# Altium schematic sheet DDR3_ZET6_OLD.SchDoc
size A3; DocumentNumber: 1; SheetNumber: 1; SheetTotal: 2
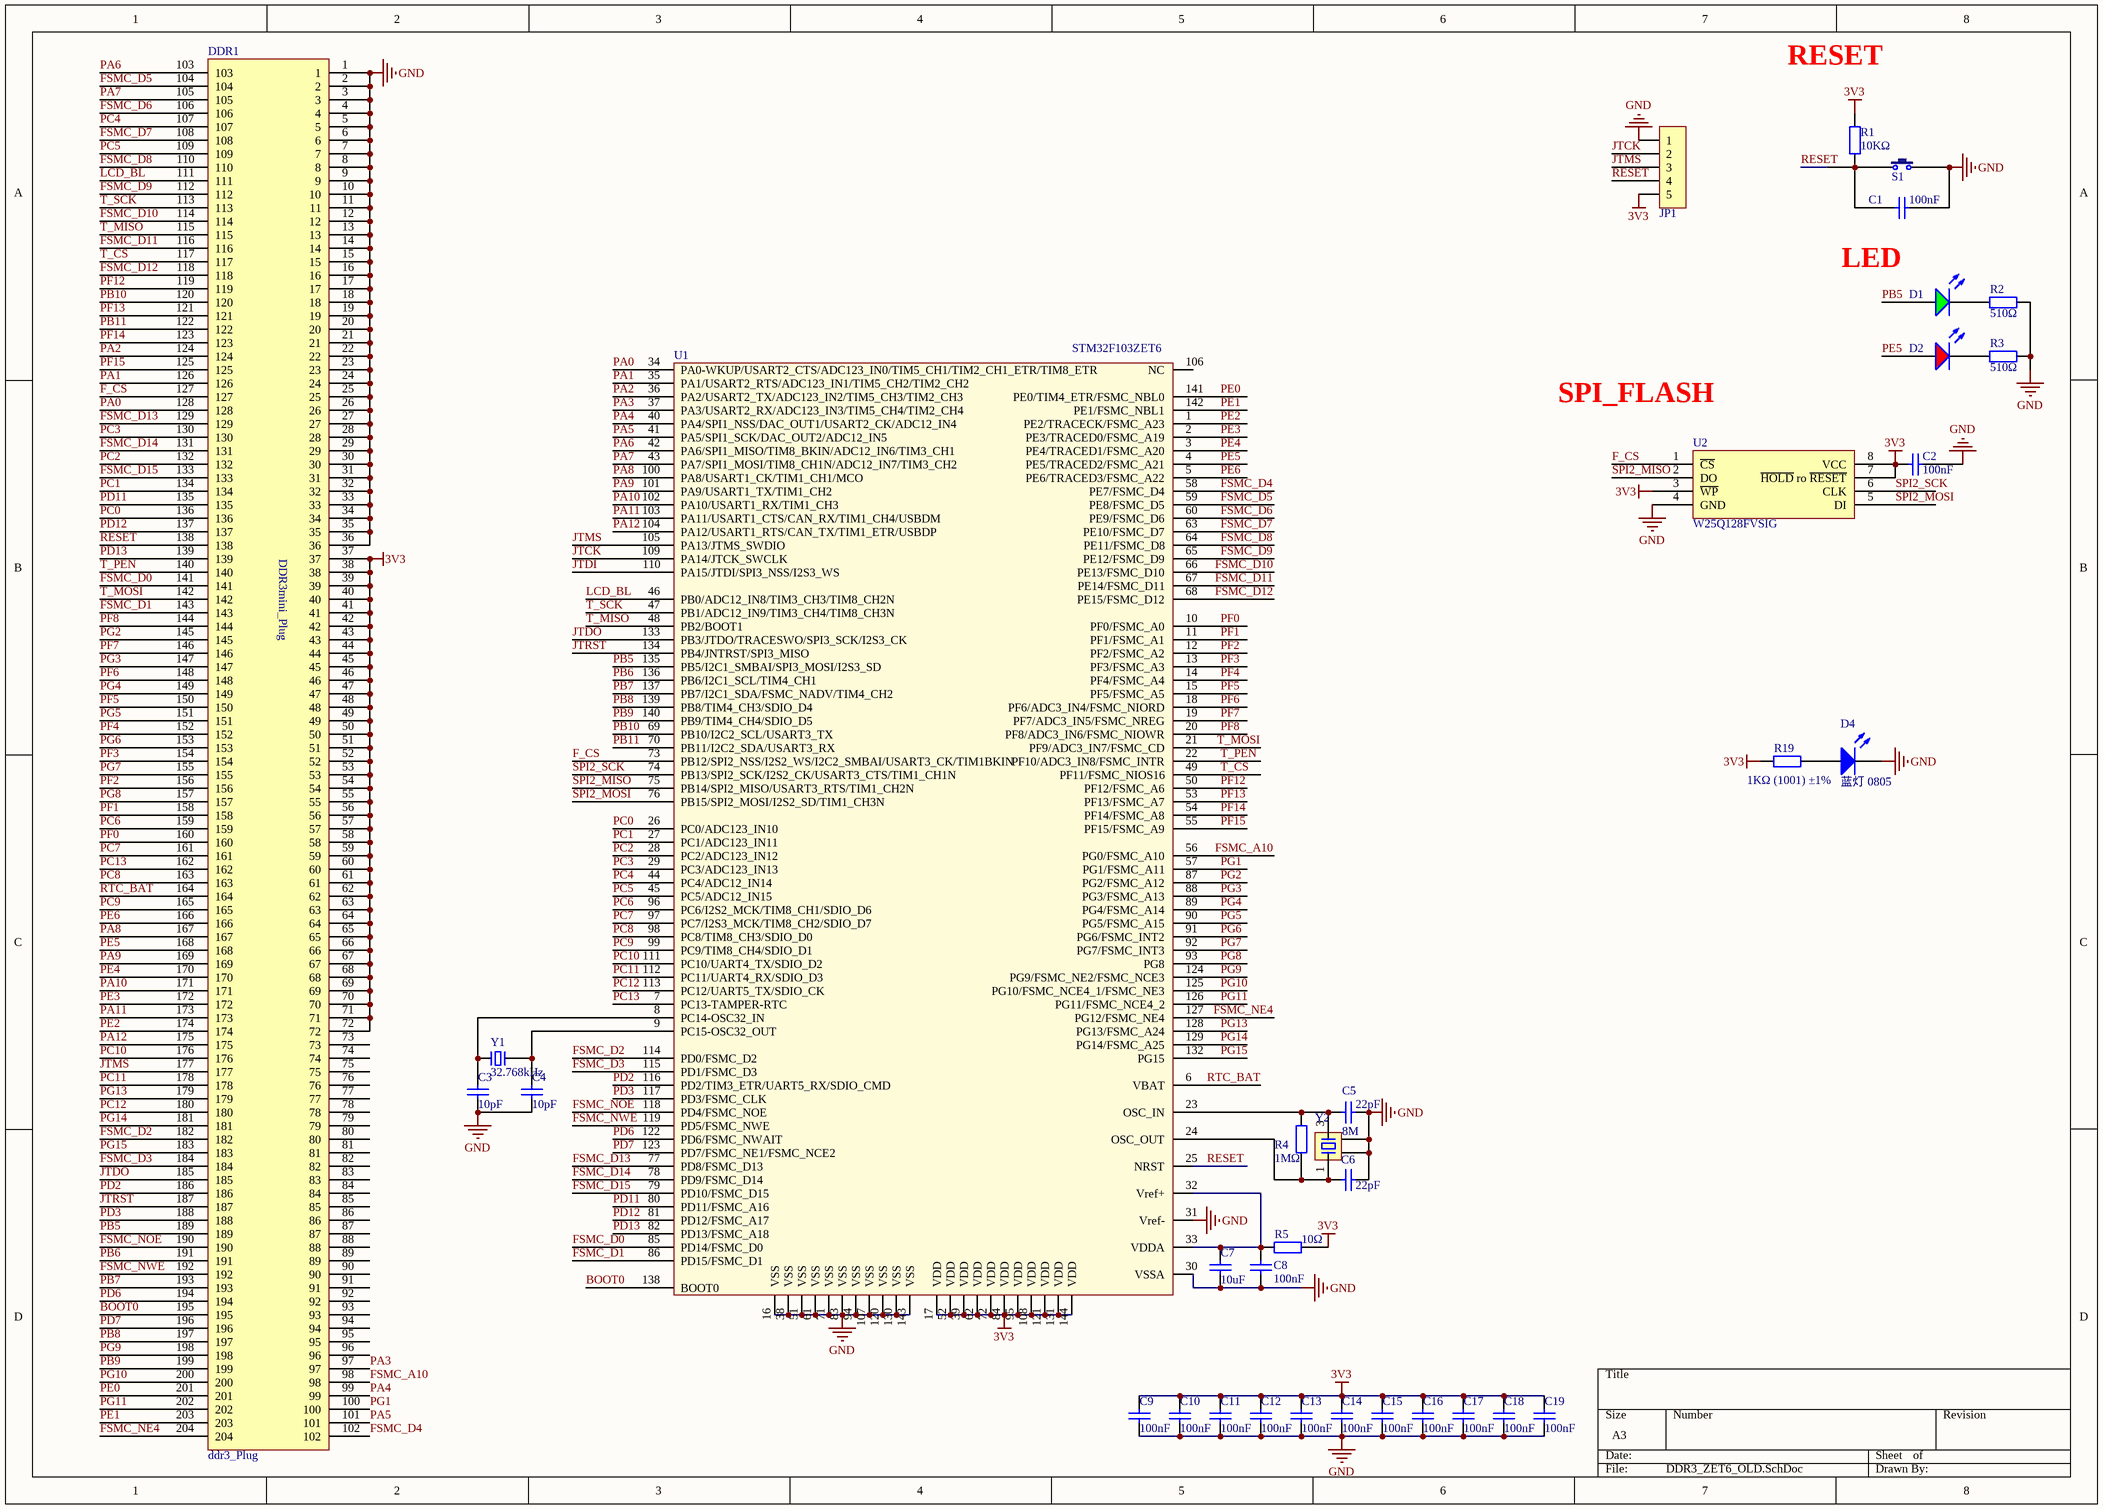
[diagram p0: DDR3_ZET6_OLD.SchDoc]

## Parts
C1  100nF  [LC-0805_C]
C2  100nF  [LC-0805_C]
C3  10pF  [LC-0805_C]
C4  10pF  [LC-0805_C]
C5  22pF  [LC-0805_C]
C6  22pF  [LC-0805_C]
C7  10uF  [LC-0805_C]
C8  100nF  [LC-0805_C]
C9  100nF  [LC-0805_C]
C10  100nF  [LC-0805_C]
C11  100nF  [LC-0805_C]
C12  100nF  [LC-0805_C]
C13  100nF  [LC-0805_C]
C14  100nF  [LC-0805_C]
C15  100nF  [LC-0805_C]
C16  100nF  [LC-0805_C]
C17  100nF  [LC-0805_C]
C18  100nF  [LC-0805_C]
C19  100nF  [LC-0805_C]
D1  翠绿 0805  [LC-0805_LED_S1]  (value not drawn)
D2  红灯 0805  [LC-0805_LED_S1]  (value not drawn)
D4  蓝灯 0805  [LC-0805_LED_S1]
DDR1  ddr3_Plug  [DDR3_PLUG_LTE]
JP1  HDR-1X5  [HDR-1X5]  (value not drawn)
R1  10KΩ  [LC-0805_R]
R2  510Ω  [LC-0805_R]
R3  510Ω  [LC-0805_R]
R4  1MΩ  [LC-0805_R]
R5  10Ω  [LC-0805_R]
R19  1KΩ (1001) ±1%  [LC-0805_R]
S1  RESET  [TSW SMD-3*6*2.5]  (value not drawn)
U1  STM32F103ZET6  [LC-LQFP-144_20x20x05P]
U2  W25Q128FVSIG  [LC-SOIC-8_208mil]
Y1  32.768kHz  [XTAL-3215]
Y2  8M  [XTAL-3225]

## Nets
3V3: C2.1 C9.2 C10.2 C11.2 C12.2 C13.2 C14.2 C15.2 C16.2 C17.2 C18.2 C19.2 DDR1.37 DDR1.38 DDR1.39 DDR1.40 DDR1.41 DDR1.42 DDR1.43 DDR1.44 DDR1.45 DDR1.46 DDR1.47 DDR1.48 DDR1.49 DDR1.50 DDR1.51 DDR1.52 DDR1.53 DDR1.54 DDR1.55 DDR1.56 DDR1.57 DDR1.58 DDR1.59 DDR1.60 DDR1.61 DDR1.62 DDR1.63 DDR1.64 DDR1.65 DDR1.66 DDR1.67 DDR1.68 DDR1.69 DDR1.70 DDR1.71 DDR1.72 JP1.5 R1.2 R5.2 R19.1 U1.17(VDD) U1.39(VDD) U1.52(VDD) U1.62(VDD) U1.72(VDD) U1.84(VDD) U1.95(VDD) U1.108(VDD) U1.121(VDD) U1.131(VDD) U1.144(VDD) U2.3(~{WP}) U2.7(~{HOLD}_ro_~{RESET}) U2.8(VCC)
GND: C1.2 C2.2 C3.1 C4.1 C5.1 C6.1 C7.1 C8.1 C9.1 C10.1 C11.1 C12.1 C13.1 C14.1 C15.1 C16.1 C17.1 C18.1 C19.1 D4.K DDR1.1 DDR1.2 DDR1.3 DDR1.4 DDR1.5 DDR1.6 DDR1.7 DDR1.8 DDR1.9 DDR1.10 DDR1.11 DDR1.12 DDR1.13 DDR1.14 DDR1.15 DDR1.16 DDR1.17 DDR1.18 DDR1.19 DDR1.20 DDR1.21 DDR1.22 DDR1.23 DDR1.24 DDR1.25 DDR1.26 DDR1.27 DDR1.28 DDR1.29 DDR1.30 DDR1.31 DDR1.32 DDR1.33 DDR1.34 DDR1.35 DDR1.36 JP1.1 R2.2 R3.2 S1.2 U1.16(VSS) U1.30(VSSA) U1.31(Vref-) U1.38(VSS) U1.51(VSS) U1.61(VSS) U1.71(VSS) U1.83(VSS) U1.94(VSS) U1.107(VSS) U1.120(VSS) U1.130(VSS) U1.143(VSS) U2.4(GND) Y2.2 Y2.4
BOOT0: DDR1.195 U1.138(BOOT0)
F_CS: DDR1.127 U1.73(PB12/SPI2_NSS/I2S2_WS/I2C2_SMBAI/USART3_CK/TIM1BKIN) U2.1(~{CS})
FSMC_A10: DDR1.98 U1.56(PG0/FSMC_A10)
FSMC_D0: DDR1.141 U1.85(PD14/FSMC_D0)
FSMC_D1: DDR1.143 U1.86(PD15/FSMC_D1)
FSMC_D2: DDR1.182 U1.114(PD0/FSMC_D2)
FSMC_D3: DDR1.184 U1.115(PD1/FSMC_D3)
FSMC_D4: DDR1.102 U1.58(PE7/FSMC_D4)
FSMC_D5: DDR1.104 U1.59(PE8/FSMC_D5)
FSMC_D6: DDR1.106 U1.60(PE9/FSMC_D6)
FSMC_D7: DDR1.108 U1.63(PE10/FSMC_D7)
FSMC_D8: DDR1.110 U1.64(PE11/FSMC_D8)
FSMC_D9: DDR1.112 U1.65(PE12/FSMC_D9)
FSMC_D10: DDR1.114 U1.66(PE13/FSMC_D10)
FSMC_D11: DDR1.116 U1.67(PE14/FSMC_D11)
FSMC_D12: DDR1.118 U1.68(PE15/FSMC_D12)
FSMC_D13: DDR1.129 U1.77(PD8/FSMC_D13)
FSMC_D14: DDR1.131 U1.78(PD9/FSMC_D14)
FSMC_D15: DDR1.133 U1.79(PD10/FSMC_D15)
FSMC_NE4: DDR1.204 U1.127(PG12/FSMC_NE4)
FSMC_NOE: DDR1.190 U1.118(PD4/FSMC_NOE)
FSMC_NWE: DDR1.192 U1.119(PD5/FSMC_NWE)
JTCK: JP1.2 U1.109(PA14/JTCK_SWCLK)
JTDI: U1.110(PA15/JTDI/SPI3_NSS/I2S3_WS)
JTDO: DDR1.185 U1.133(PB3/JTDO/TRACESWO/SPI3_SCK/I2S3_CK)
JTMS: DDR1.177 JP1.3 U1.105(PA13/JTMS_SWDIO)
JTRST: DDR1.187 U1.134(PB4/JNTRST/SPI3_MISO)
LCD_BL: DDR1.111 U1.46(PB0/ADC12_IN8/TIM3_CH3/TIM8_CH2N)
PA0: DDR1.128 U1.34(PA0-WKUP/USART2_CTS/ADC123_IN0/TIM5_CH1/TIM2_CH1_ETR/TIM8_ETR)
PA1: DDR1.126 U1.35(PA1/USART2_RTS/ADC123_IN1/TIM5_CH2/TIM2_CH2)
PA2: DDR1.124 U1.36(PA2/USART2_TX/ADC123_IN2/TIM5_CH3/TIM2_CH3)
PA3: DDR1.97 U1.37(PA3/USART2_RX/ADC123_IN3/TIM5_CH4/TIM2_CH4)
PA4: DDR1.99 U1.40(PA4/SPI1_NSS/DAC_OUT1/USART2_CK/ADC12_IN4)
PA5: DDR1.101 U1.41(PA5/SPI1_SCK/DAC_OUT2/ADC12_IN5)
PA6: DDR1.103 U1.42(PA6/SPI1_MISO/TIM8_BKIN/ADC12_IN6/TIM3_CH1)
PA7: DDR1.105 U1.43(PA7/SPI1_MOSI/TIM8_CH1N/ADC12_IN7/TIM3_CH2)
PA8: DDR1.167 U1.100(PA8/USART1_CK/TIM1_CH1/MCO)
PA9: DDR1.169 U1.101(PA9/USART1_TX/TIM1_CH2)
PA10: DDR1.171 U1.102(PA10/USART1_RX/TIM1_CH3)
PA11: DDR1.173 U1.103(PA11/USART1_CTS/CAN_RX/TIM1_CH4/USBDM)
PA12: DDR1.175 U1.104(PA12/USART1_RTS/CAN_TX/TIM1_ETR/USBDP)
PB5: D1.A DDR1.189 U1.135(PB5/I2C1_SMBAI/SPI3_MOSI/I2S3_SD)
PB6: DDR1.191 U1.136(PB6/I2C1_SCL/TIM4_CH1)
PB7: DDR1.193 U1.137(PB7/I2C1_SDA/FSMC_NADV/TIM4_CH2)
PB8: DDR1.197 U1.139(PB8/TIM4_CH3/SDIO_D4)
PB9: DDR1.199 U1.140(PB9/TIM4_CH4/SDIO_D5)
PB10: DDR1.120 U1.69(PB10/I2C2_SCL/USART3_TX)
PB11: DDR1.122 U1.70(PB11/I2C2_SDA/USART3_RX)
PC0: DDR1.136 U1.26(PC0/ADC123_IN10)
PC1: DDR1.134 U1.27(PC1/ADC123_IN11)
PC2: DDR1.132 U1.28(PC2/ADC123_IN12)
PC3: DDR1.130 U1.29(PC3/ADC123_IN13)
PC4: DDR1.107 U1.44(PC4/ADC12_IN14)
PC5: DDR1.109 U1.45(PC5/ADC12_IN15)
PC6: DDR1.159 U1.96(PC6/I2S2_MCK/TIM8_CH1/SDIO_D6)
PC7: DDR1.161 U1.97(PC7/I2S3_MCK/TIM8_CH2/SDIO_D7)
PC8: DDR1.163 U1.98(PC8/TIM8_CH3/SDIO_D0)
PC9: DDR1.165 U1.99(PC9/TIM8_CH4/SDIO_D1)
PC10: DDR1.176 U1.111(PC10/UART4_TX/SDIO_D2)
PC11: DDR1.178 U1.112(PC11/UART4_RX/SDIO_D3)
PC12: DDR1.180 U1.113(PC12/UART5_TX/SDIO_CK)
PC13: DDR1.162 U1.7(PC13-TAMPER-RTC)
PD2: DDR1.186 U1.116(PD2/TIM3_ETR/UART5_RX/SDIO_CMD)
PD3: DDR1.188 U1.117(PD3/FSMC_CLK)
PD6: DDR1.194 U1.122(PD6/FSMC_NWAIT)
PD7: DDR1.196 U1.123(PD7/FSMC_NE1/FSMC_NCE2)
PD11: DDR1.135 U1.80(PD11/FSMC_A16)
PD12: DDR1.137 U1.81(PD12/FSMC_A17)
PD13: DDR1.139 U1.82(PD13/FSMC_A18)
PE0: DDR1.201 U1.141(PE0/TIM4_ETR/FSMC_NBL0)
PE1: DDR1.203 U1.142(PE1/FSMC_NBL1)
PE2: DDR1.174 U1.1(PE2/TRACECK/FSMC_A23)
PE3: DDR1.172 U1.2(PE3/TRACED0/FSMC_A19)
PE4: DDR1.170 U1.3(PE4/TRACED1/FSMC_A20)
PE5: D2.A DDR1.168 U1.4(PE5/TRACED2/FSMC_A21)
PE6: DDR1.166 U1.5(PE6/TRACED3/FSMC_A22)
PF0: DDR1.160 U1.10(PF0/FSMC_A0)
PF1: DDR1.158 U1.11(PF1/FSMC_A1)
PF2: DDR1.156 U1.12(PF2/FSMC_A2)
PF3: DDR1.154 U1.13(PF3/FSMC_A3)
PF4: DDR1.152 U1.14(PF4/FSMC_A4)
PF5: DDR1.150 U1.15(PF5/FSMC_A5)
PF6: DDR1.148 U1.18(PF6/ADC3_IN4/FSMC_NIORD)
PF7: DDR1.146 U1.19(PF7/ADC3_IN5/FSMC_NREG)
PF8: DDR1.144 U1.20(PF8/ADC3_IN6/FSMC_NIOWR)
PF12: DDR1.119 U1.50(PF12/FSMC_A6)
PF13: DDR1.121 U1.53(PF13/FSMC_A7)
PF14: DDR1.123 U1.54(PF14/FSMC_A8)
PF15: DDR1.125 U1.55(PF15/FSMC_A9)
PG1: DDR1.100 U1.57(PG1/FSMC_A11)
PG2: DDR1.145 U1.87(PG2/FSMC_A12)
PG3: DDR1.147 U1.88(PG3/FSMC_A13)
PG4: DDR1.149 U1.89(PG4/FSMC_A14)
PG5: DDR1.151 U1.90(PG5/FSMC_A15)
PG6: DDR1.153 U1.91(PG6/FSMC_INT2)
PG7: DDR1.155 U1.92(PG7/FSMC_INT3)
PG8: DDR1.157 U1.93(PG8)
PG9: DDR1.198 U1.124(PG9/FSMC_NE2/FSMC_NCE3)
PG10: DDR1.200 U1.125(PG10/FSMC_NCE4_1/FSMC_NE3)
PG11: DDR1.202 U1.126(PG11/FSMC_NCE4_2)
PG13: DDR1.179 U1.128(PG13/FSMC_A24)
PG14: DDR1.181 U1.129(PG14/FSMC_A25)
PG15: DDR1.183 U1.132(PG15)
RESET: C1.1 DDR1.138 JP1.4 R1.1 S1.1 U1.25(NRST)
RTC_BAT: DDR1.164 U1.6(VBAT)
SPI2_MISO: U1.75(PB14/SPI2_MISO/USART3_RTS/TIM1_CH2N) U2.2(DO)
SPI2_MOSI: U1.76(PB15/SPI2_MOSI/I2S2_SD/TIM1_CH3N) U2.5(DI)
SPI2_SCK: U1.74(PB13/SPI2_SCK/I2S2_CK/USART3_CTS/TIM1_CH1N) U2.6(CLK)
T_CS: DDR1.117 U1.49(PF11/FSMC_NIOS16)
T_MISO: DDR1.115 U1.48(PB2/BOOT1)
T_MOSI: DDR1.142 U1.21(PF9/ADC3_IN7/FSMC_CD)
T_PEN: DDR1.140 U1.22(PF10/ADC3_IN8/FSMC_INTR)
T_SCK: DDR1.113 U1.47(PB1/ADC12_IN9/TIM3_CH4/TIM8_CH3N)
NetC3_2: C3.2 U1.8(PC14-OSC32_IN) Y1.1
NetC4_2: C4.2 U1.9(PC15-OSC32_OUT) Y1.2
NetC5_2: C5.2 R4.1 U1.23(OSC_IN) Y2.3
NetC6_2: C6.2 R4.2 U1.24(OSC_OUT) Y2.1
NetC7_2: C7.2 C8.2 R5.1 U1.32(Vref+) U1.33(VDDA)
NetD1_K: D1.K R2.1
NetD2_K: D2.K R3.1
NetD4_A: D4.A R19.2

Not connected (* = marked no-connect by the designer): DDR1 73 74 75 76 77 78 79 80 81 82 83 84 85 86 87 88 89 90 91 92 93 94 95 96; U1 106(NC)

## Notes on the sheet
- RESET
- LED
- SPI_FLASH
- (in symbol ddr3_Plug) DDR3mini_Plug

## Library data of the parts
C1 C2 C8-C19 = 0805 100nF(104) 10% 50V: 贴片电容; ComponentLink1Description: 供应商链接; ComponentLink1URL: http://www.szlcsc.com/product/details_50686.html; Package: 0805; Supplier: LC; SuppliersPartNumber: C49678
C3 C4 = 0805 10pF (100) 5% 50V: 贴片电容; ComponentLink1Description: 供应商链接; ComponentLink1URL: http://www.szlcsc.com/product/details_2137.html; Package: 0805; Supplier: LC; SuppliersPartNumber: C1785
C5 C6 = 0805 22pF (220) 5% 50V: 贴片电容; ComponentLink1Description: 供应商链接; ComponentLink1URL: http://www.szlcsc.com/product/details_2156.html; Package: 0805; Supplier: LC; SuppliersPartNumber: C1804
C7 = 0805 10uF (106) 10% 25V: 贴片电容; ComponentLink1Description: 供应商链接; ComponentLink1URL: http://www.szlcsc.com/product/details_16532.html; Package: 0805; Supplier: LC; SuppliersPartNumber: C15850
D1 = 0805 翠绿: 发光二极管; ComponentLink1Description: 供应商链接; ComponentLink1URL: http://www.szlcsc.com/product/details_2670.html; Package: 0805; Supplier: LC; SuppliersPartNumber: C2297
D2 = 0805 红灯: 发光二极管; ComponentLink1Description: 供应商链接; ComponentLink1URL: http://www.szlcsc.com/product/details_2668.html; Package: 0805; Supplier: LC; SuppliersPartNumber: C2295
D4 = 0805 蓝灯: 发光二极管; ComponentLink1Description: 供应商链接; ComponentLink1URL: http://www.szlcsc.com/product/details_2666.html; Package: 0805; Supplier: LC; SuppliersPartNumber: C2293
JP1 = Header 5: 5P接插件; 版权归属: 黎明电子style; BOM名称: 5P接插件; 学习资源: https://lmdzstyle.taobao.com/
R1 = 0805 10KΩ (1002) 1%: 贴片电阻; ComponentLink1Description: 供应商链接; ComponentLink1URL: http://www.szlcsc.com/product/details_18102.html; Package: 0805; Supplier: LC; SuppliersPartNumber: C17414
R2 R3 = 0805 510Ω (5100) 1%: 贴片电阻; ComponentLink1Description: 供应商链接; ComponentLink1URL: http://www.szlcsc.com/product/details_18422.html; Package: 0805; Supplier: LC; SuppliersPartNumber: C17734
R4 = 0805 1MΩ (1004) 1%: 贴片电阻; ComponentLink1Description: 供应商链接; ComponentLink1URL: http://www.szlcsc.com/product/details_18202.html; Package: 0805; Supplier: LC; SuppliersPartNumber: C17514
R5 = 0805 10Ω (10R0) 1%: 贴片电阻; ComponentLink1Description: 供应商链接; ComponentLink1URL: http://www.szlcsc.com/product/details_18103.html; Package: 0805; Supplier: LC; SuppliersPartNumber: C17415
R19 = 0805 1KΩ (1001) 1%: 贴片电阻; ComponentLink1Description: 供应商链接; ComponentLink1URL: http://www.szlcsc.com/product/details_18201.html; Package: 0805; Supplier: LC; SuppliersPartNumber: C17513
S1 = TSW 3x6: 3x6轻触开关; 版权归属: 黎明电子style; BOM名称: 3x6轻触开关; 学习资源: https://lmdzstyle.taobao.com/
U2 = W25Q128FVSIG: Flash ROM; ComponentLink1Description: 供应商链接; ComponentLink1URL: http://www.szlcsc.com/product/details_36072.html; Package: SOIC-8; Supplier: LC; SuppliersPartNumber: C35101
Y1 = XTAL-2: 2脚晶振; 版权归属: 黎明电子style; BOM名称: 2脚晶振; 学习资源: https://lmdzstyle.taobao.com/
Y2 = XTAL-4: 4脚晶振; 版权归属: 黎明电子style; BOM名称: 4脚晶振; 学习资源: https://lmdzstyle.taobao.com/